# Altium project MainBoard.PrjPCB
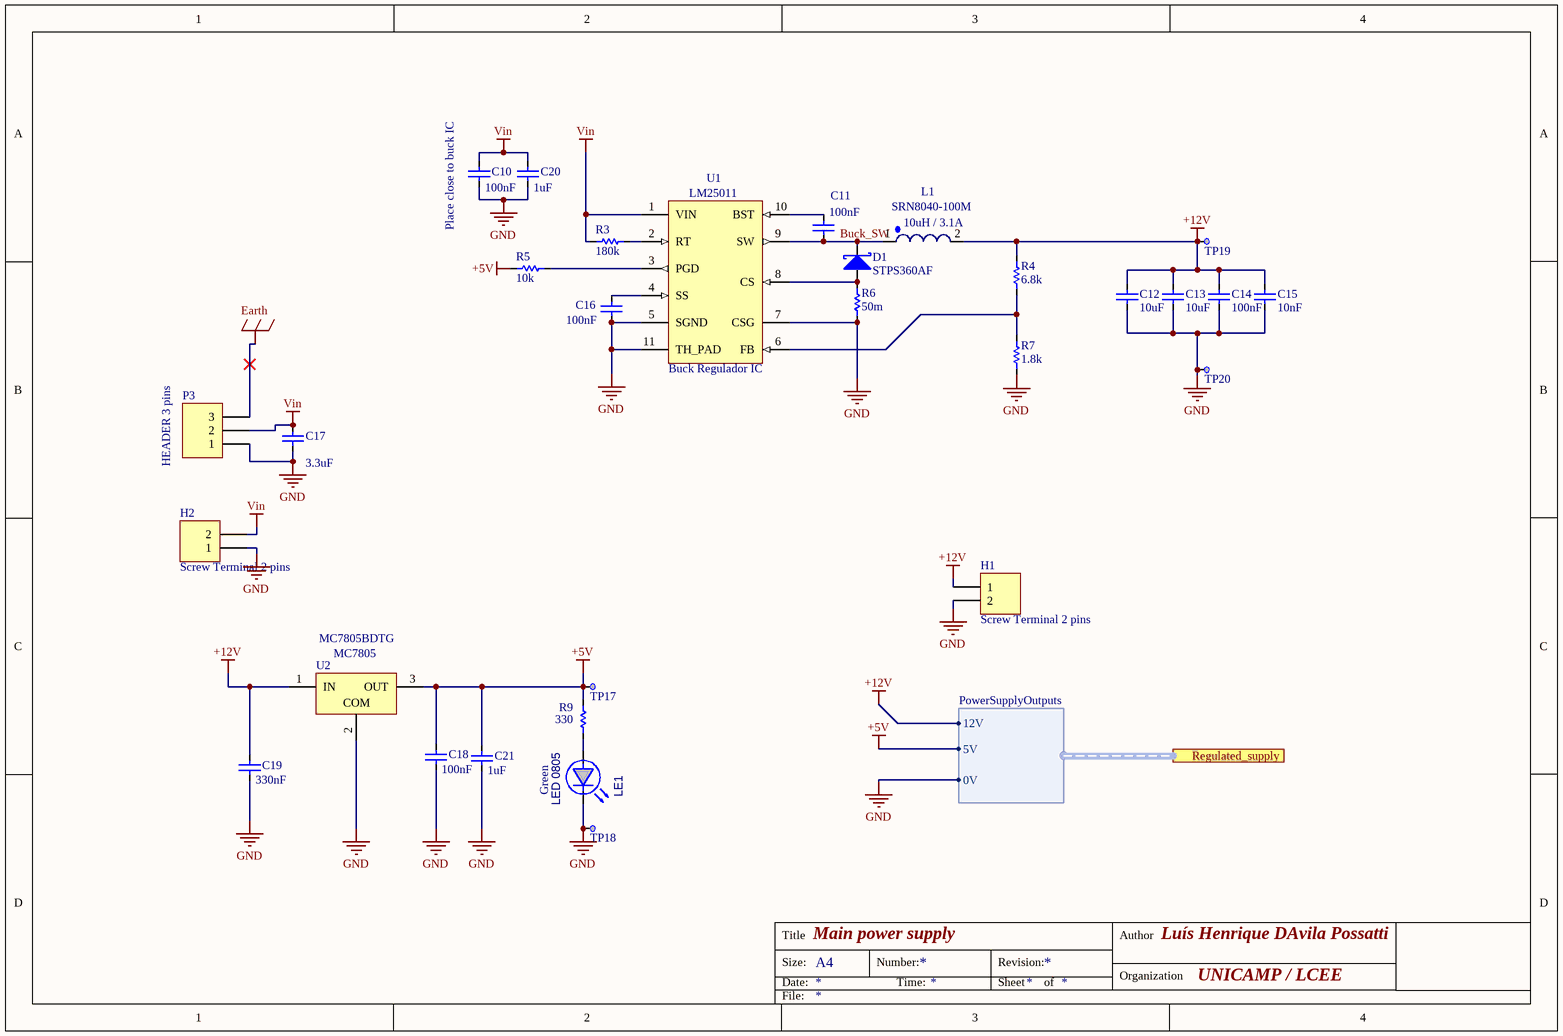
[diagram p0: MainPowerSupply.SchDoc]
=Rule: Luis Henrique
4 sheets, 101 parts. Net scope: hierarchical (ports join the sheet entries above them; power ports are global).
Board file: MainBoard_PCB.PcbDoc
Sheets:
  MainPowerSupply.SchDoc
  Input_signals.SchDoc
  FullBridge.SchDoc
    HalfBridge_A = Halfbridge.SchDoc
    HalfBridge_B = Halfbridge.SchDoc

## Sheet MainPowerSupply.SchDoc: Main power supply
size A4; Author: Luís Henrique DAvila Possatti; Organization: UNICAMP / LCEE; Address1: University of Campinas - Brazil; Address2: Power Conditioning Laboratory; Address3: Licensed by GNU GPL 3.0; ProjectName: Easy Inverter

### Parts
C10  Place close to buck IC  value 100nF  [Capacitor 0805]
C11  value 100nF  [Capacitor 0805]  (hidden comment: Capacitor 0805)
C12  value 10uF  [Capacitor 0805]  (hidden comment: Capacitor 0805)
C13  value 10uF  [Capacitor 0805]  (hidden comment: Capacitor 0805)
C14  value 100nF  [Capacitor 0805]  (hidden comment: Capacitor 0805)
C15  value 10nF  [Capacitor 0805]  (hidden comment: Capacitor 0805)
C16  value 100nF  [Capacitor 0805]  (hidden comment: Capacitor 0805)
C17  value 3.3uF  [Capacitor 0805]  (hidden comment: Place close to input)
C18  value 100nF  [Capacitor 0805]  (hidden comment: Place close do MC7805)
C19  value 330nF  [Capacitor 0805]  (hidden comment: Place close do MC7805)
C20  value 1uF  [Capacitor 0805]  (hidden comment: Place close to buck IC)
C21  value 1uF  [Capacitor 0805]  (hidden comment: Place close do MC7805)
D1  STPS360AF  [SOD 128]
H1  Screw Terminal 2 pins  [OSTTA020161]
H2  Screw Terminal 2 pins  [OSTTA020161]
L1  SRN8040-100M  value 10uH / 3.1A  [SRN8040]
LE1  value LED 0805  Color: Green  [LED 0805 Green]  (hidden comment: LEDSMD 0805)
P3  HEADER 3 pins  [HDR1X3]
R3  value 180k  [Resistor 0805]  (hidden comment: Resistor 0805)
R4  value 6.8k  [Resistor 0805]  (hidden comment: Resistor 0805)
R5  value 10k  [Resistor 0805]  (hidden comment: Resistor 0805)
R6  value 50m  [Resistor 0805]  (hidden comment: MCS1632R050FER)
R7  value 1.8k  [Resistor 0805]  (hidden comment: Resistor 0805)
R9  value 330  [Resistor 0805]  (hidden comment: Resistor 0805)
TP17  Name of signal  [Test point]  (value not drawn)  (no BOM)
TP18  Name of signal  [Test point]  (value not drawn)  (no BOM)
TP19  Name of signal  [Test point]  (value not drawn)  (no BOM)
TP20  Name of signal  [Test point]  (value not drawn)  (no BOM)
U1  Buck Regulador IC  value LM25011  [HVSSOP 10]
U2  MC7805BDTG  value MC7805  [DPAK-3]

### Ports
Regulated_supply (harness PowerSupplyOutputs)

### Harnesses
PowerSupplyOutputs: 12V, 5V, 0V

### Nets
+5V: C18.1 C21.1 R5.1 R9.2 TP17.1 U2.3(OUT) ; port Regulated_supply.5V
+12V: C12.1 C13.1 C14.1 C15.1 C19.1 H1.1 L1.2 R4.2 TP19.1 U2.1(IN) ; port Regulated_supply.12V
Earth: P3.3
GND: C10.2 C12.2 C13.2 C14.2 C15.2 C16.2 C17.2 C18.2 C19.2 C20.2 C21.2 H1.2 H2.1 LE1.2 P3.1 R6.1 R7.1 TP18.1 TP20.1 U1.5(SGND) U1.7(CSG) U1.11(TH_PAD) U2.2(COM) ; port Regulated_supply.0V
Vin: C10.1 C17.1 C20.1 H2.2 P3.2 R3.1 U1.1(VIN)
Buck_SW: C11.2 D1.2(K) L1.1 U1.9(SW)
NetC11_1: C11.1 U1.10(BST)
NetC16_1: C16.1 U1.4(SS)
NetD1_1: D1.1(A) R6.2 U1.8(CS)
NetLE1_1: LE1.1 R9.1
NetR3_2: R3.2 U1.2(RT)
NetR4_1: R4.1 R7.2 U1.6(FB)
NetR5_2: R5.2 U1.3(PGD)

### Notes on the sheet
- Title
- Size:
- Date:
- A4
- Number:
- Time:
- Revision:
- Sheet
- of
- Author
- Organization
- File:

### Library data of the parts
C10-C21 = Capacitor 0805: SMD ceramic capacitor 0805; pn: undefined
  C10 C20: ClassName: Buck_circuit, direct_plane_connect
  C11 C16: ClassName: Buck_circuit
  C12-C15: ClassName: Buck_circuit, strong_connection
  C17: ClassName: direct_plane_connect
  C18 C19 C21: ClassName: strong_connection
D1 = STPS360AF: DIODE SCHOTTKY 60V 3A SOD128; pn: STPS360AF; ComponentLink1Description: Datasheet; ComponentLink1URL: http://www.st.com/content/ccc/resource/technical/document/datasheet/group3/06/00/c2/7f/e8/20/4a/81/DM00306268/files/DM00306268.pdf/jcr:content/translations/en.DM00306268.pdf; ClassName: Buck_circuit
H1 H2 = OSTTA020161: Value: Two wire screw terminal; pn: OSTTA020161; ClassName: strong_connection
L1 = SRN8040-100M: Inductor 10UH 3.1A 50 mΩ SMD; pn: SRN8040-100M; ComponentLink2Description: Datasheet; ComponentLink2URL: http://www.we-online.de/katalog/media/pdf/744862180.pdf; ClassName: Buck_circuit, strong_connection
P3 = HEADER 3 pins: Header 2.54mm 3 pins; PN: ?
R3-R5 R7 R9 = Resistor 0805: SMD resistor 0805; pn: undefined
  R3-R5 R7: ClassName: Buck_circuit
R6 = MCS1632R050FER: RESISTOR 0.05 OHM 1% 1W SMD 1206; pn: MCS1632R050FER; ClassName: Buck_circuit, strong_connection
TP17 = Test point: Test point to probe with oscilloscope; Signal_name: 5V; ClassName: Direct_plane_connect
TP18 TP20 = Test point: Test point to probe with oscilloscope; Signal_name: GND; ClassName: Direct_plane_connect
TP19 = Test point: Test point to probe with oscilloscope; Signal_name: 12V; ClassName: Direct_plane_connect
U1 = LM25011: IC REG BUCK ADJ 2A 10MSOP; pn: LM25011MYX/NOPB; ComponentLink1Description: Datasheet; ComponentLink1URL: http://www.ti.com/lit/ds/symlink/lm25011.pdf; ClassName: Buck_circuit
U2 = MC7805BDTG: IC REG LINEAR 5V 1A DPAK-3; pn: MC7805BDTG; ComponentLink1Description: Datasheet; ComponentLink1URL: http://www.onsemi.com/pub/Collateral/MC7800-D.PDF; ClassName: strong_connection

## Sheet Input_signals.SchDoc
size A4; Author: Luis Henrique DAvila Possatti; Organization: University of Campinas
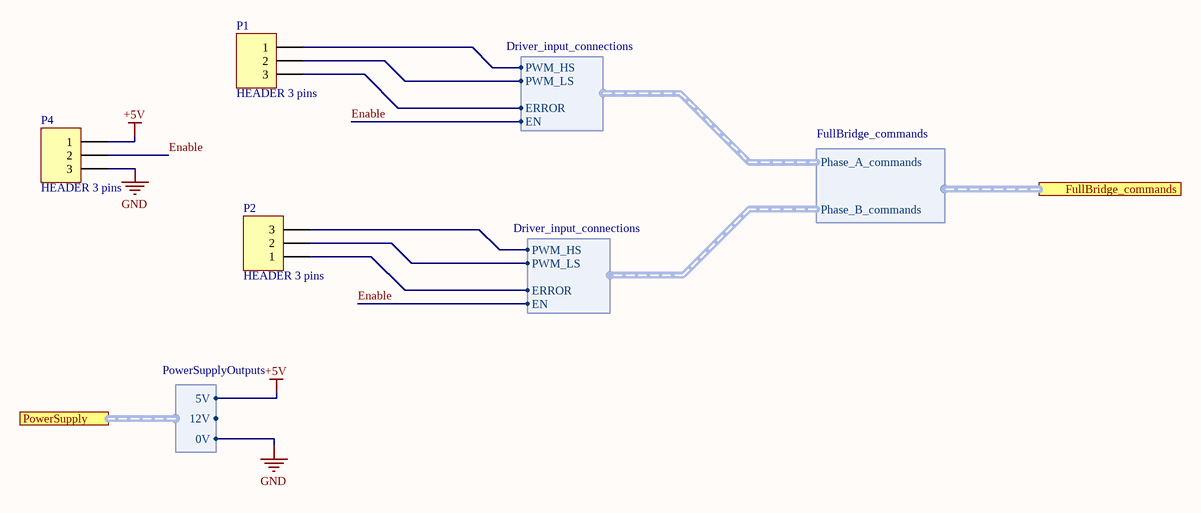
[diagram p1: Input_signals.SchDoc]

### Parts
P1  HEADER 3 pins  [HDR1X3]
P2  HEADER 3 pins  [HDR1X3]
P4  HEADER 3 pins  [HDR1X3 - Jumper]

### Ports
FullBridge_commands (harness FullBridge_commands), PowerSupply (harness PowerSupplyOutputs)

### Harnesses
Driver_input_connections: EN, ERROR, PWM_HS, PWM_LS
FullBridge_commands: Phase_A_commands, Phase_B_commands
PowerSupplyOutputs: 0V, 12V, 5V

### Nets
+5V: P4.1 ; port PowerSupply.5V
GND: P4.3 ; port PowerSupply.0V
Enable: P4.2 ; harness Driver_input_connections.EN
NetP1_1: P1.1 ; harness Driver_input_connections.PWM_HS
NetP1_2: P1.2 ; harness Driver_input_connections.PWM_LS
NetP1_3: P1.3 ; harness Driver_input_connections.ERROR
NetP2_1: P2.1 ; harness Driver_input_connections.ERROR
NetP2_2: P2.2 ; harness Driver_input_connections.PWM_LS
NetP2_3: P2.3 ; harness Driver_input_connections.PWM_HS

### Notes on the sheet
- Title
- Size:
- Date:
- A4
- Number:
- Time:
- Revision:
- Sheet
- of
- Author
- Organization
- File:

### Library data of the parts
P1 = HEADER 3 pins: Header 2.54mm 3 pins; Pin_3_signal: HS_in; Pin_2_signal: LS_in; Pin_1_signal: Error_out; jumper_message: Side A signals; PN: ?
P2 = HEADER 3 pins: Header 2.54mm 3 pins; Pin_3_signal: HS_in; Pin_2_signal: LS_in; Pin_1_signal: Error_out; jumper_message: Side B signals; PN: ?
P4 = HEADER 3 pins: Header 2.54mm 3 pins; Pin_3_signal: GND; Pin_2_signal: Enable; Pin_1_signal: +5V; jumper_message: Select enable; PN: ?

## Sheet FullBridge.SchDoc
size A4; Author: Luis Henrique DAvila Possatti; Organization: University of Campinas
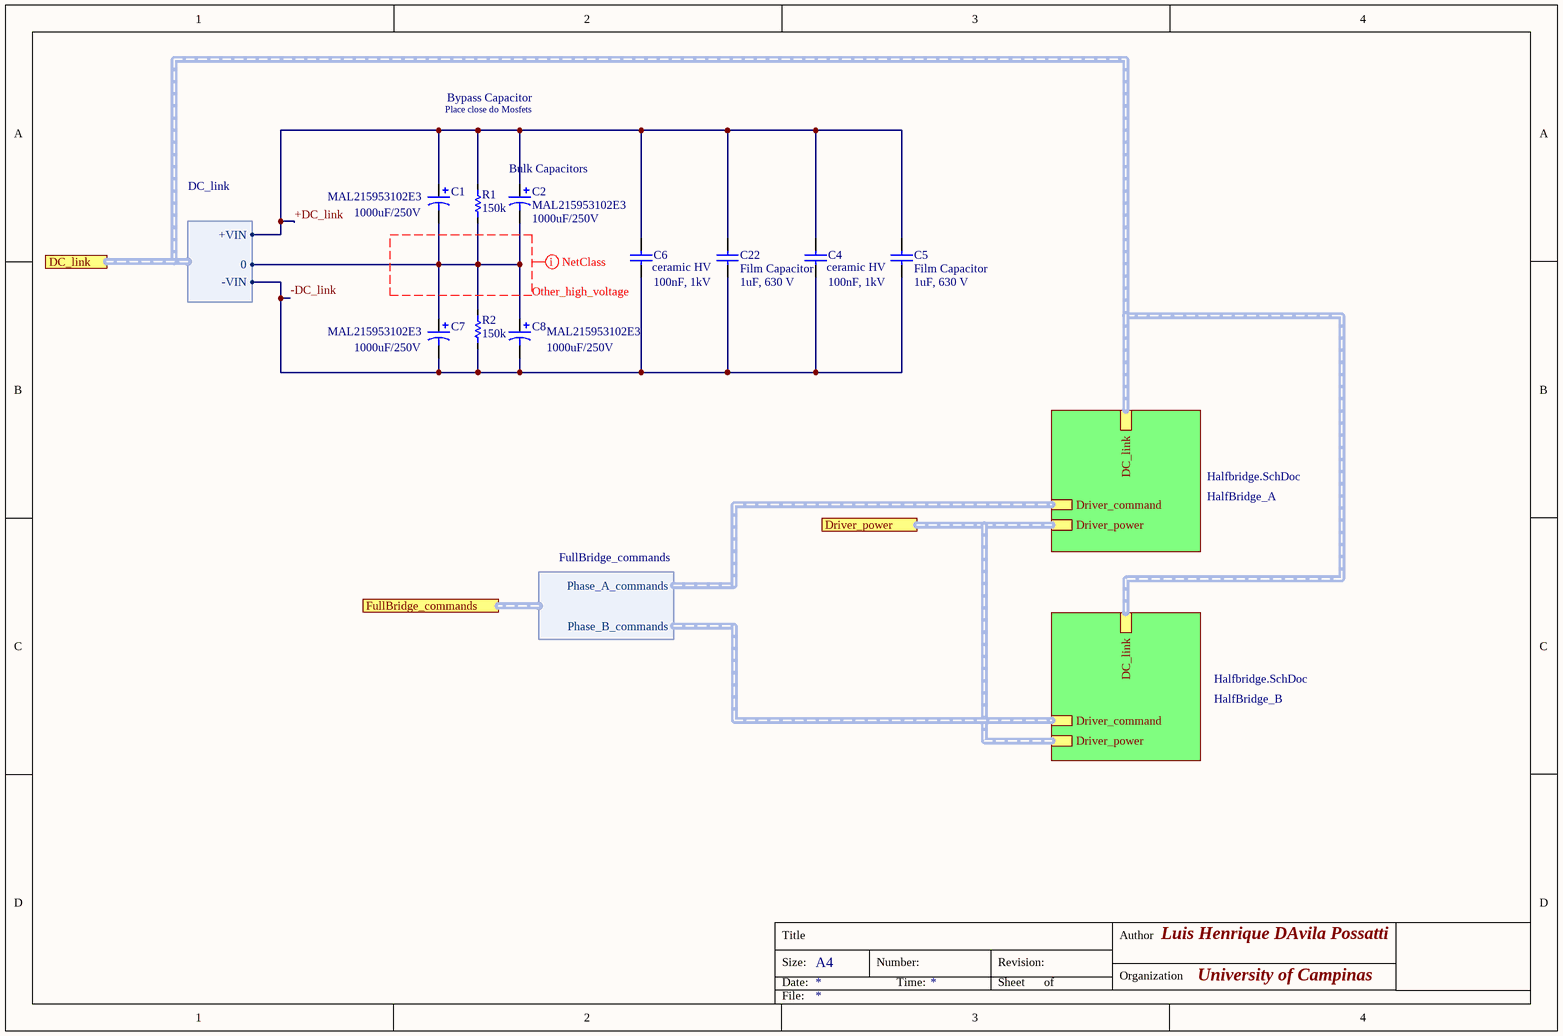
[diagram p2: FullBridge.SchDoc]

### Parts
C1  MAL215953102E3  value 1000uF/250V  [Radial 35D40H10P]
C2  MAL215953102E3  value 1000uF/250V  [Radial 35D40H10P]
C4  ceramic HV  value 100nF, 1kV  [CAPACITOR 1812]
C5  Film Capacitor  value 1uF, 630 V  [MIXED Film Capacitors]
C6  ceramic HV  value 100nF, 1kV  [CAPACITOR 1812]
C7  MAL215953102E3  value 1000uF/250V  [Radial 35D40H10P]
C8  MAL215953102E3  value 1000uF/250V  [Radial 35D40H10P]
C22  Film Capacitor  value 1uF, 630 V  [MIXED Film Capacitors]
R1  value 150k  [Resistor 2512]  (hidden comment: CRCW2512150KFKEG)
R2  value 150k  [Resistor 2512]  (hidden comment: CRCW2512150KFKEG)

### Sub-sheets
HalfBridge_A = Halfbridge.SchDoc: Driver_command (harness Driver_input_connections), Driver_power (harness PowerSupplyOutputs), DC_link (harness DC_link)
HalfBridge_B = Halfbridge.SchDoc: Driver_command (harness Driver_input_connections), Driver_power (harness PowerSupplyOutputs), DC_link (harness DC_link)

### Ports
DC_link (harness DC_link), Driver_power (harness PowerSupplyOutputs), FullBridge_commands (harness FullBridge_commands)

### Harnesses
FullBridge_commands: Phase_A_commands, Phase_B_commands
DC_link: +VIN, -VIN, 0

### Nets
+DC_link: C1.1 C2.1 C4.1 C5.1 C6.1 C22.1 R1.2 ; port DC_link.+VIN
-DC_link: C4.2 C5.2 C6.2 C7.2 C8.2 C22.2 R2.1 ; port DC_link.-VIN
NetC1_2: C1.2 C2.2 C7.1 C8.1 R1.1 R2.2 ; port DC_link.0

### Buses and harness runs
harness port DC_link = sheet HalfBridge_A/DC_link = sheet HalfBridge_B/DC_link
harness port Driver_power = sheet HalfBridge_A/Driver_power = sheet HalfBridge_B/Driver_power

### Layout directives
net class Other_high_voltage: (no net found under the mark)

### Notes on the sheet
- Place close do Mosfets
- Bypass Capacitor
- Bulk Capacitors
- Title
- Size:
- Date:
- A4
- Number:
- Time:
- Revision:
- Sheet
- of
- Author
- Organization
- File:

### Library data of the parts
C1 C2 C7 C8 = MAL215953102E3: Aluminum Electrolytic Capacitor 1000UF 20% 250V SNAP; pn: MAL215953102E3; ClassName: strong_connection
C4 C6 = Capacitor ceramic High Voltage: High Voltage Ceramic SMD capacitor, two part numbers, 100nF; pn: C1210C104KBRAC7800, C1812C104KDRAC7800; ClassName: strong_connection
C5 C22 = Capacitor Metalized Film: Metalized Film Capacitor, two part numbers; pn: PHE844RR7100MR06L2 ,B32794D2106K; ClassName: strong_connection
R1 R2 = CRCW2512150KFKEG: SMD resistor 2512, 150kOhm; pn: CRCW2512150KFKEG

## Sheet Halfbridge.SchDoc
size A4; Author: Luis Henrique DAvila Possatti; Organization: University of Campinas
Used 2 times, as channels HalfBridge_A, HalfBridge_B. Parts and nets are listed once, with the designators drawn on the sheet.
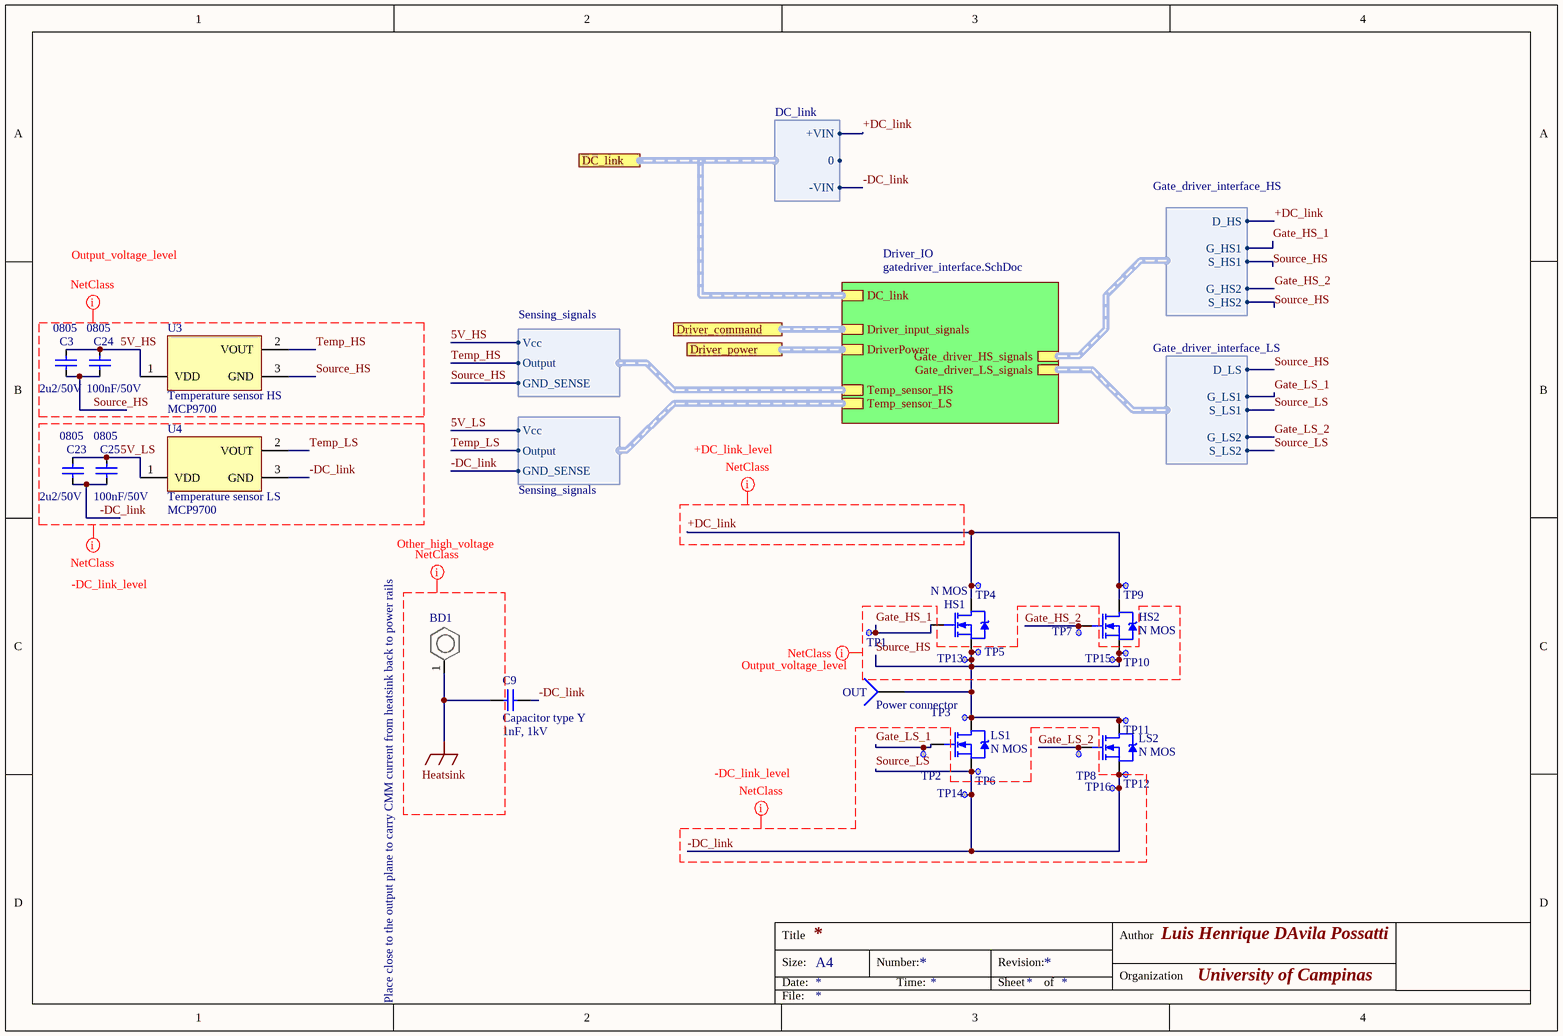
[diagram p3: Halfbridge.SchDoc]

### Parts
BD1  Place near output plane  [Bonding_screw]  (value not drawn)
C3  0805  value 2u2/50V  [Capacitor 0805]
C9  Capacitor type Y  value 1nF, 1kV  [CAPACITOR 1812]
C23  0805  value 2u2/50V  [Capacitor 0805]
C24  0805  value 100nF/50V  [Capacitor 0805]
C25  0805  value 100nF/50V  [Capacitor 0805]
HS1  N MOS  [TO247 custom 4]
HS2  N MOS  [TO247 custom 4]
LS1  N MOS  [TO247 custom 4]
LS2  N MOS  [TO247 custom 4]
OUT  Power connector  [7799 Power Connector]
TP1  Test point  [Test point]  (value not drawn)  (no BOM)
TP2  Test point  [Test point]  (value not drawn)  (no BOM)
TP3  Test point  [Test point]  (value not drawn)  (no BOM)
TP4  Test point  [Test point]  (value not drawn)  (no BOM)
TP5  Test point  [Test point SMD]  (value not drawn)  (no BOM)
TP6  Test point  [Test point]  (value not drawn)  (no BOM)
TP7  Test point  [Test point]  (value not drawn)  (no BOM)
TP8  Test point  [Test point]  (value not drawn)  (no BOM)
TP9  Test point  [Test point]  (value not drawn)  (no BOM)
TP10  Test point  [Test point SMD]  (value not drawn)  (no BOM)
TP11  Test point  [Test point]  (value not drawn)  (no BOM)
TP12  Test point  [Test point]  (value not drawn)  (no BOM)
TP13  Test point  [Test point SMD]  (value not drawn)  (no BOM)
TP14  Test point  [Test point]  (value not drawn)  (no BOM)
TP15  Test point  [Test point SMD]  (value not drawn)  (no BOM)
TP16  Test point  [Test point]  (value not drawn)  (no BOM)
U3  Temperature sensor HS  value MCP9700  [SOT 23]
U4  Temperature sensor LS  value MCP9700  [SOT 23]

### Sub-sheets
Driver_IO = gatedriver_interface.SchDoc (file not in this document): Gate_driver_HS_signals (harness Gate_driver_interface_HS), Gate_driver_LS_signals (harness Gate_driver_interface_LS), Driver_input_signals (harness Driver_input_connections), DriverPower (harness PowerSupplyOutputs), Temp_sensor_HS (harness Sensing_signals), Temp_sensor_LS (harness Sensing_signals), DC_link (harness DC_link)

### Ports
DC_link (harness DC_link), Driver_command (harness Driver_input_connections), Driver_power (harness PowerSupplyOutputs)

### Harnesses
Gate_driver_interface_HS: G_HS1, S_HS1, G_HS2, S_HS2, D_HS
Gate_driver_interface_LS: G_LS1, S_LS1, G_LS2, S_LS2, D_LS
DC_link: +VIN, -VIN, 0
Sensing_signals: GND_SENSE, Output, Vcc

### Nets
Heatsink: BD1.1 C9.1
5V_HS: C3.1 C24.1 U3.1(VDD) ; sheet Driver_IO/Temp_sensor_HS.Vcc
5V_LS: C23.1 C25.1 U4.1(VDD) ; sheet Driver_IO/Temp_sensor_LS.Vcc
+DC_link: HS1.2(D) HS2.2(D) TP4.1 TP9.1 ; sheet Driver_IO/Gate_driver_HS_signals.D_HS, port DC_link.+VIN
-DC_link: C9.2 C23.2 C25.2 LS1.3(S) LS2.3(S) TP6.1 TP12.1 TP14.1 TP16.1 U4.3(GND) ; sheet Driver_IO/Gate_driver_LS_signals.S_LS1, sheet Driver_IO/Gate_driver_LS_signals.S_LS2, port DC_link.-VIN, sheet Driver_IO/Temp_sensor_LS.GND_SENSE  [also labelled Source_LS]
Gate_HS_1: HS1.1(G) TP1.1 ; sheet Driver_IO/Gate_driver_HS_signals.G_HS1
Gate_HS_2: HS2.1(G) TP7.1 ; sheet Driver_IO/Gate_driver_HS_signals.G_HS2
Gate_LS_1: LS1.1(G) TP2.1 ; sheet Driver_IO/Gate_driver_LS_signals.G_LS1
Gate_LS_2: LS2.1(G) TP8.1 ; sheet Driver_IO/Gate_driver_LS_signals.G_LS2
Source_HS: C3.2 C24.2 HS1.3(S) HS2.3(S) LS1.2(D) LS2.2(D) OUT.1 TP3.1 TP5.1 TP10.1 TP11.1 TP13.1 TP15.1 U3.3(GND) ; sheet Driver_IO/Gate_driver_HS_signals.S_HS1, sheet Driver_IO/Gate_driver_HS_signals.S_HS2, sheet Driver_IO/Gate_driver_LS_signals.D_LS, sheet Driver_IO/Temp_sensor_HS.GND_SENSE
Temp_HS: U3.2(VOUT) ; sheet Driver_IO/Temp_sensor_HS.Output
Temp_LS: U4.2(VOUT) ; sheet Driver_IO/Temp_sensor_LS.Output

### Channels
HalfBridge_A: designators end in A
HalfBridge_B: designators end in B

### Buses and harness runs
harness port DC_link = sheet Driver_IO/DC_link
harness port Driver_command = sheet Driver_IO/Driver_input_signals
harness port Driver_power = sheet Driver_IO/DriverPower

### Layout directives
net class -DC_link_level: 5V_LS, -DC_link, Gate_LS_1, Gate_LS_2, Source_LS, Temp_LS
net class Output_voltage_level: 5V_HS, Gate_HS_1, Gate_HS_2, Source_HS, Temp_HS
net class +DC_link_level: +DC_link
net class Other_high_voltage: Heatsink

### Notes on the sheet
- (near BD1) Place close to the output plane to carry CMM current from heatsink back to power rails
- Title
- Size:
- Date:
- A4
- Number:
- Time:
- Revision:
- Sheet
- of
- Author
- Organization
- File:

### Library data of the parts
BD1 = Bonding_screw: Used to connect the net to the heatsink below board; value: Pan Head; pn: M3 screw
C3 C23-C25 = Capacitor 0805: as C10 on sheet MainPowerSupply
C9 = Y Capacitor: High Voltage Capacitor to filter EMC from heatsink; pn: C1210C104KBRAC7800, C1812C104KDRAC7800; ClassName: Direct_plane_connect
HS1 HS2 LS1 LS2 = MOSFET: Power Mosfet N channel, TO-247, multiple part numbers; PN: SCT2280KEC, STW28N65M2, IRFP4321PBFD; Value: 14A, 1200V; ClassName: Direct_plane_connect, Mosfets
OUT = Power connector: TERM SCREW M4 6 PIN PCB; PN: 36-7799-ND; Value: Connector 7799; ClassName: Direct_plane_connect
TP1 = Test point: Test point to probe with oscilloscope; Signal_name: G1_HS; ClassName: Direct_plane_connect, test_point
TP2 = Test point: Test point to probe with oscilloscope; Signal_name: G1_LS; ClassName: Direct_plane_connect, test_point
TP3 = Test point: Test point to probe with oscilloscope; Signal_name: D1_LS; ClassName: Direct_plane_connect, test_point
TP4 = Test point: Test point to probe with oscilloscope; Signal_name: D1_HS; ClassName: Direct_plane_connect, test_point
TP5 TP13 = Test point: Test point to probe with oscilloscope; Signal_name: S1_HS; ClassName: Direct_plane_connect, test_point
TP6 TP14 = Test point: Test point to probe with oscilloscope; Signal_name: S1_LS; ClassName: Direct_plane_connect, test_point
TP7 = Test point: Test point to probe with oscilloscope; Signal_name: G2_HS; ClassName: Direct_plane_connect, test_point
TP8 = Test point: Test point to probe with oscilloscope; Signal_name: G2_LS; ClassName: Direct_plane_connect, test_point
TP9 = Test point: Test point to probe with oscilloscope; Signal_name: D2_HS; ClassName: Direct_plane_connect, test_point
TP10 TP15 = Test point: Test point to probe with oscilloscope; Signal_name: S2_HS; ClassName: Direct_plane_connect, test_point
TP11 = Test point: Test point to probe with oscilloscope; Signal_name: D2_LS; ClassName: Direct_plane_connect, test_point
TP12 TP16 = Test point: Test point to probe with oscilloscope; Signal_name: S2_LS; ClassName: Direct_plane_connect, test_point
U3 U4 = MCP9700T-E/TT: Low-Power Linear Active Thermistor IC, 3-Pin SOT-23, Extended Temperature, Tape and Reel; ComponentLink1Description: Manufacturer URL; ComponentLink1URL: http://www.microchip.com/; ComponentLink2Description: Datasheet; ComponentLink2URL: http://ww1.microchip.com/downloads/en/DeviceDoc/21942e.pdf; ComponentLink3Description: Package Specification; ComponentLink3URL: http://www.microchip.com/stellent/groups/techpub_sg/documents/packagingspec/en012702.pdf; pn: MCP9700T-E/TT
  U4: ClassName: Direct_plane_connect

## Nets that join several sheets
+5V: MainPowerSupply (6 pins), Input_signals (P4.1)
GND: MainPowerSupply (23 pins), Input_signals (P4.3)
Heatsink: HalfBridge_A (BD1A.1 C9A.1), HalfBridge_B (BD1B.1 C9B.1)
+DC_link: FullBridge (7 pins), HalfBridge_A (HS1A.2 HS2A.2 TP4A.1 TP9A.1), HalfBridge_B (HS1B.2 HS2B.2 TP4B.1 TP9B.1)
-DC_link: FullBridge (7 pins), HalfBridge_A (10 pins), HalfBridge_B (10 pins)